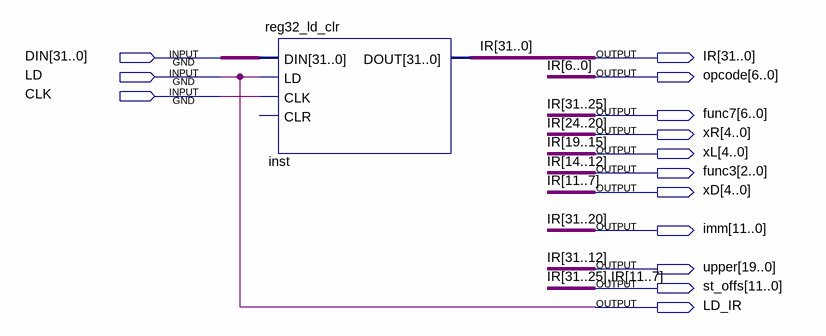
[diagram p0: schematic sheet]
// Quartus schematic instrreg.bdf as structural Verilog: 1 symbols, 14 pins
module instrreg (
  input  [31:0] DIN,
  input  LD,
  input  CLK,
  output [31:0] IR,
  output [6:0] opcode,
  output [6:0] func7,
  output [4:0] xR,
  output [4:0] xL,
  output [2:0] func3,
  output [4:0] xD,
  output [11:0] imm,
  output [19:0] upper,
  output [11:0] st_offs,
  output LD_IR
);

  reg32_ld_clr inst (.DIN(DIN), .LD(LD), .CLK(CLK), .DOUT({func7, imm[4:0], IR[19:15], func3, IR[11:0]}));  // open: CLR

  assign imm[11:5] = func7;
  assign {IR[31:20], IR[14:12]} = {func7, imm[4:0], func3};
  assign LD_IR = LD;
  assign opcode = IR[6:0];
  assign st_offs = {func7, IR[11:7]};
  assign upper = {func7, imm[4:0], IR[19:15], func3};
  assign xD = IR[11:7];
  assign xL = IR[19:15];
  assign xR = imm[4:0];
endmodule
